# EasyEDA Pro project JLCEDA_AT_START_F455_V1.0.epro, schematic AT-START-F455 V1.0

## Sheets
1 MCU: Board Name: AT-START-F455_v1.0; Create Date: 2024-11-06; Page Name: MCU; Project Name: AT-START-F455; Schematic Name: AT-START-F455 V1.0; Update Date: 2024-12-31; Company: Artery Technology; Drawed: SD; Page Size: A4; Version: 1.0
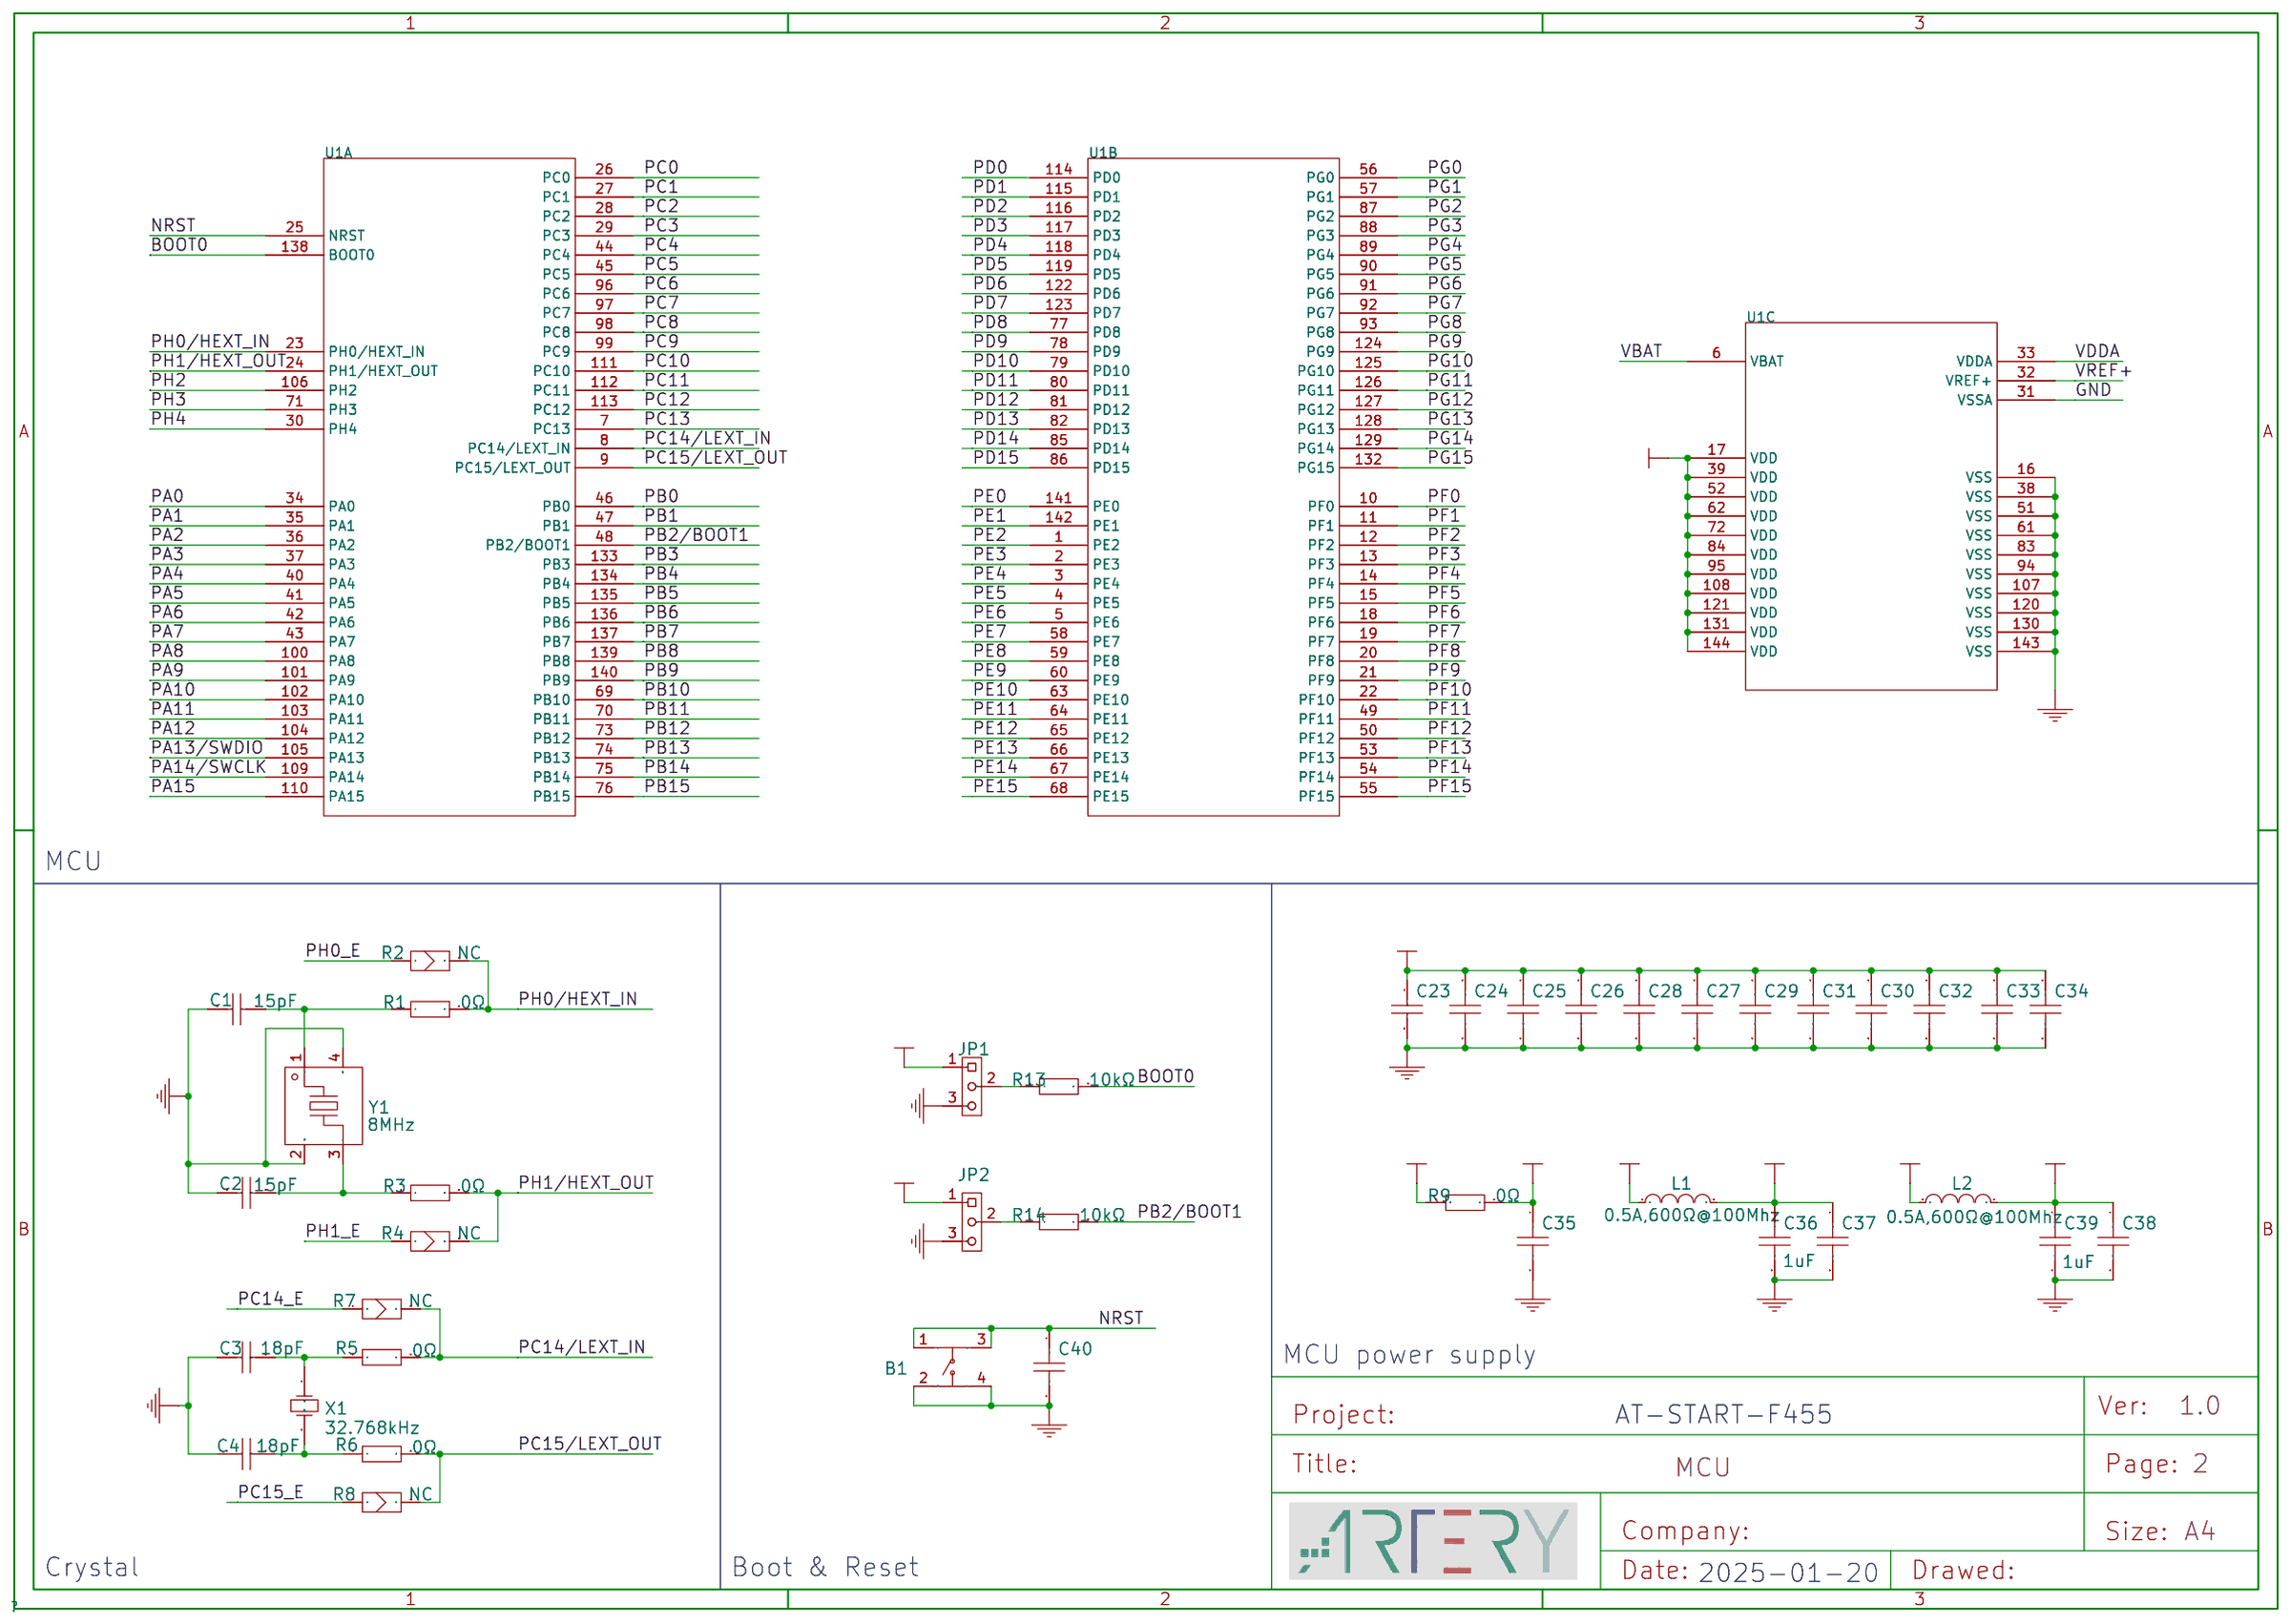
[diagram p0: MCU]
2 Power & Peripherals: Page Name: Power & Peripherals; Update Date: 2025-01-22
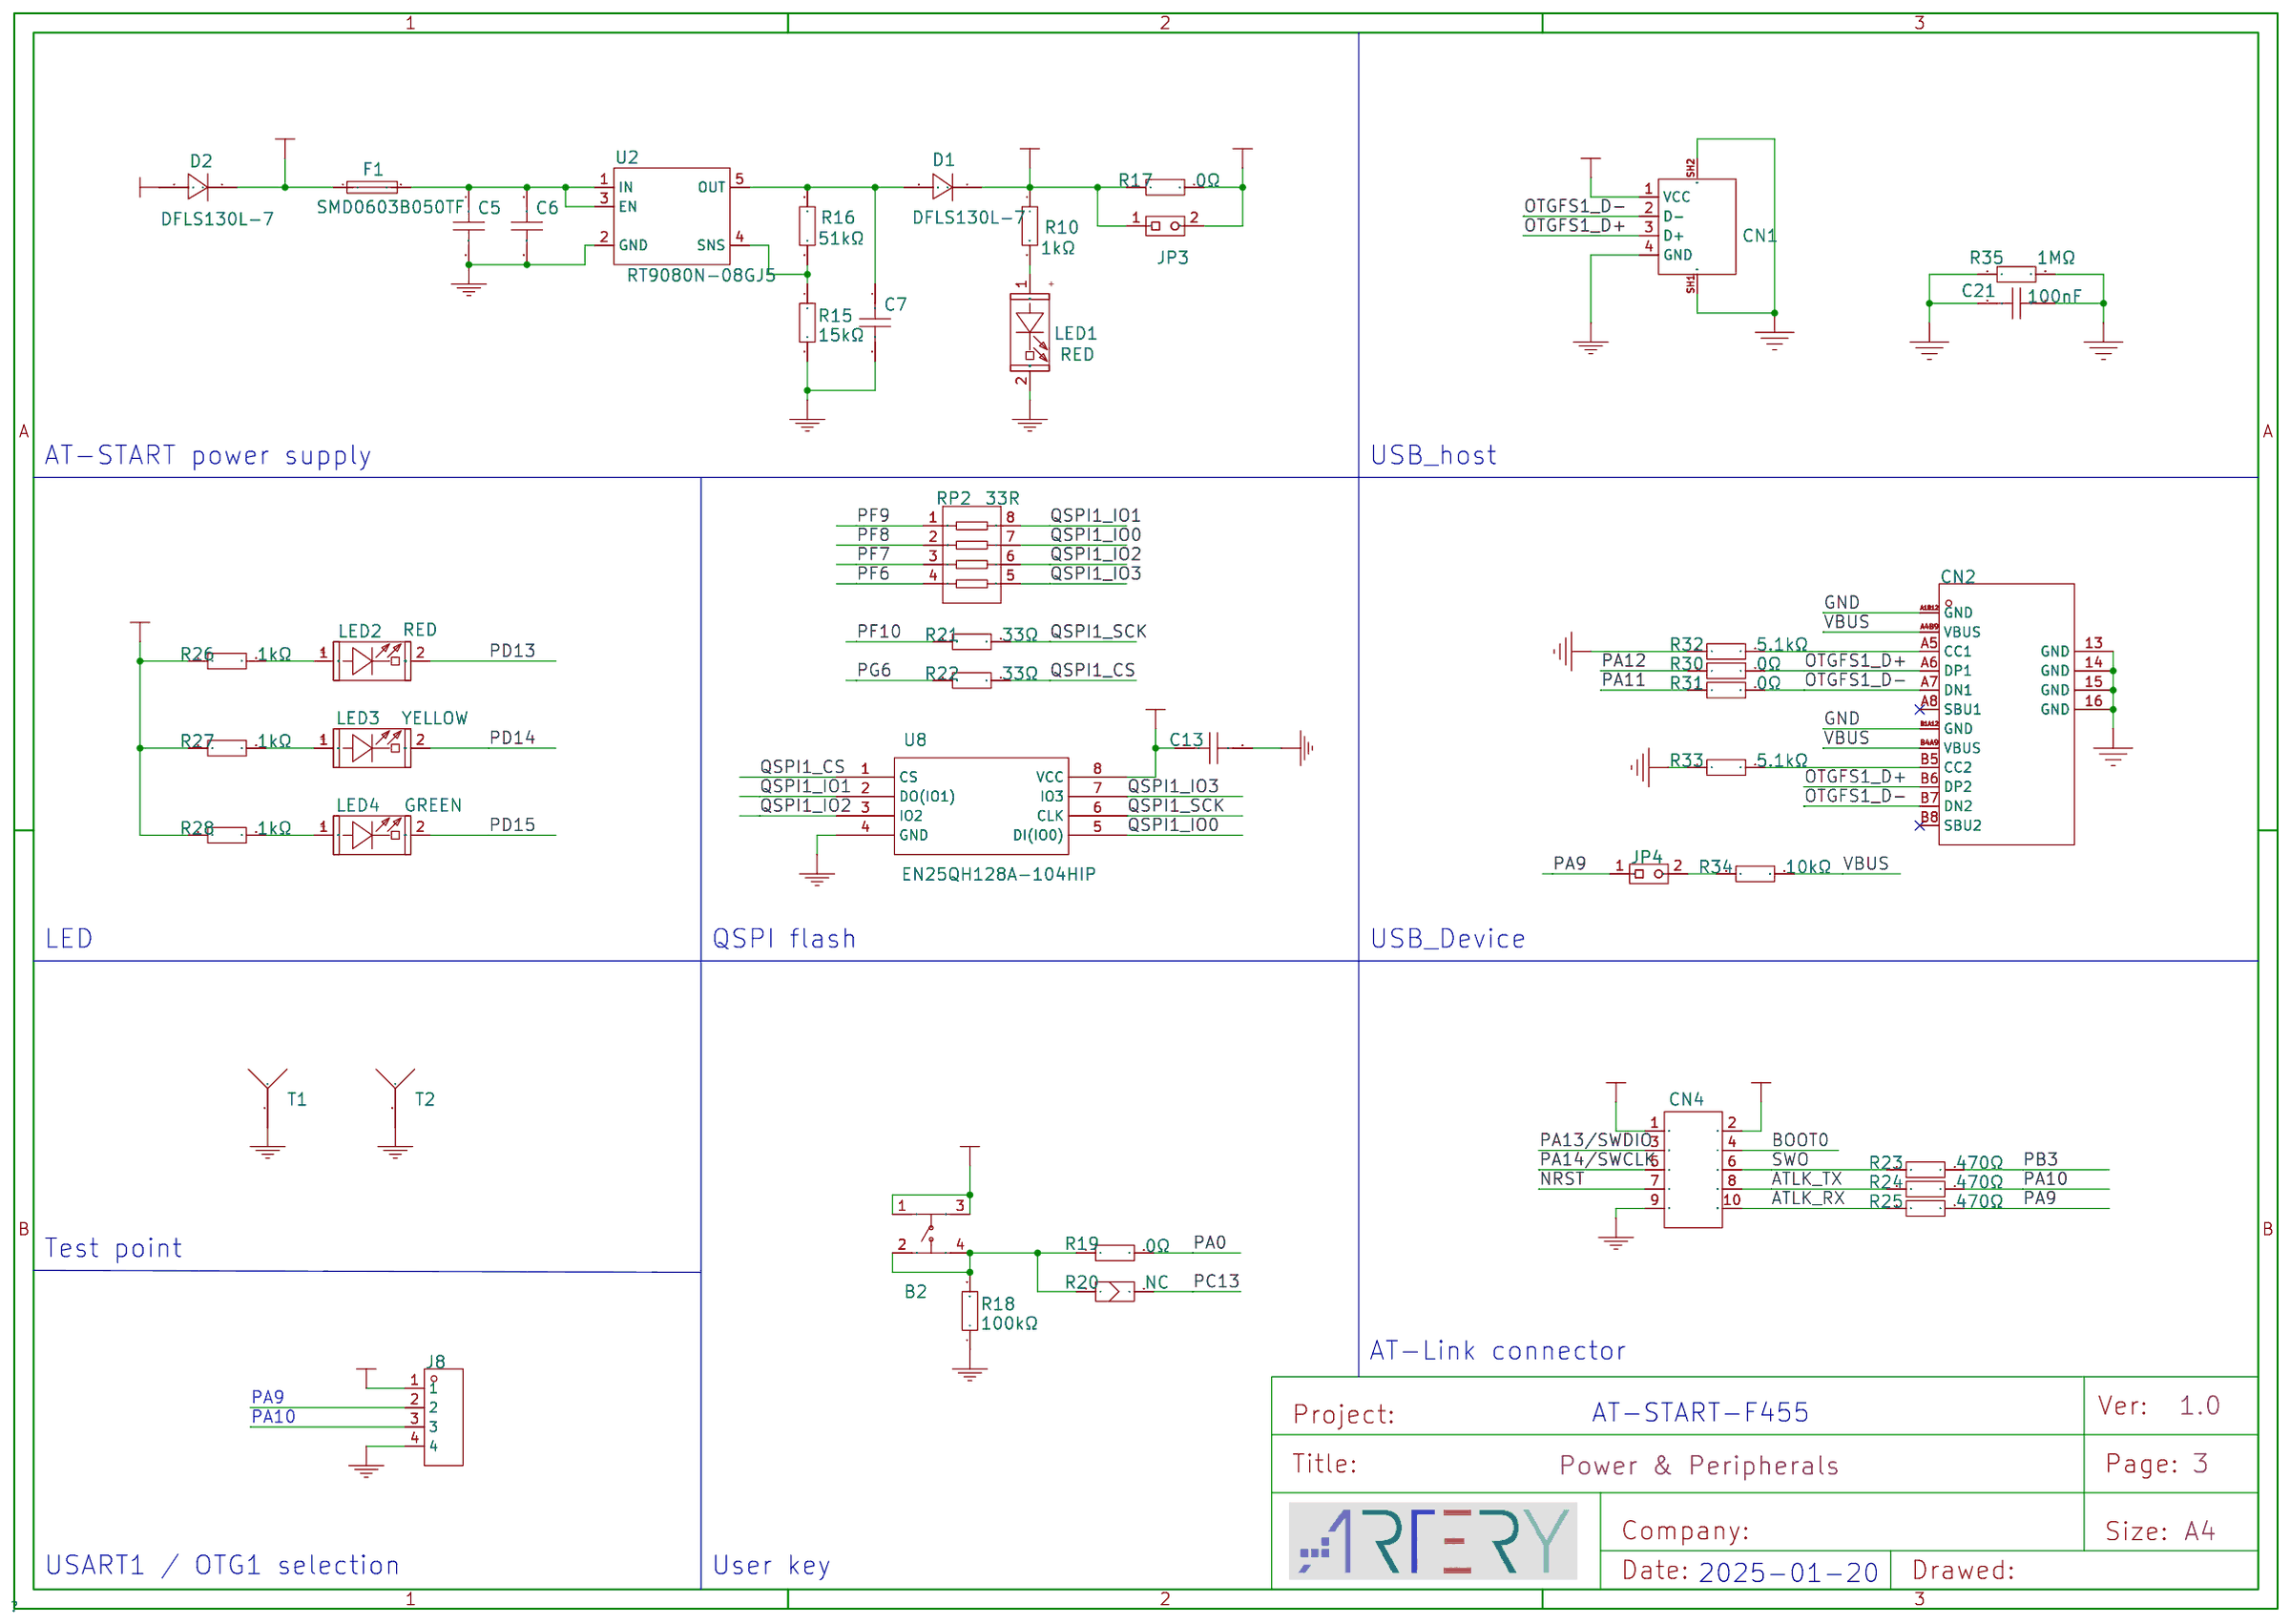
[diagram p1: Power & Peripherals]
3 Extension connectors: Page Name: Extension connectors
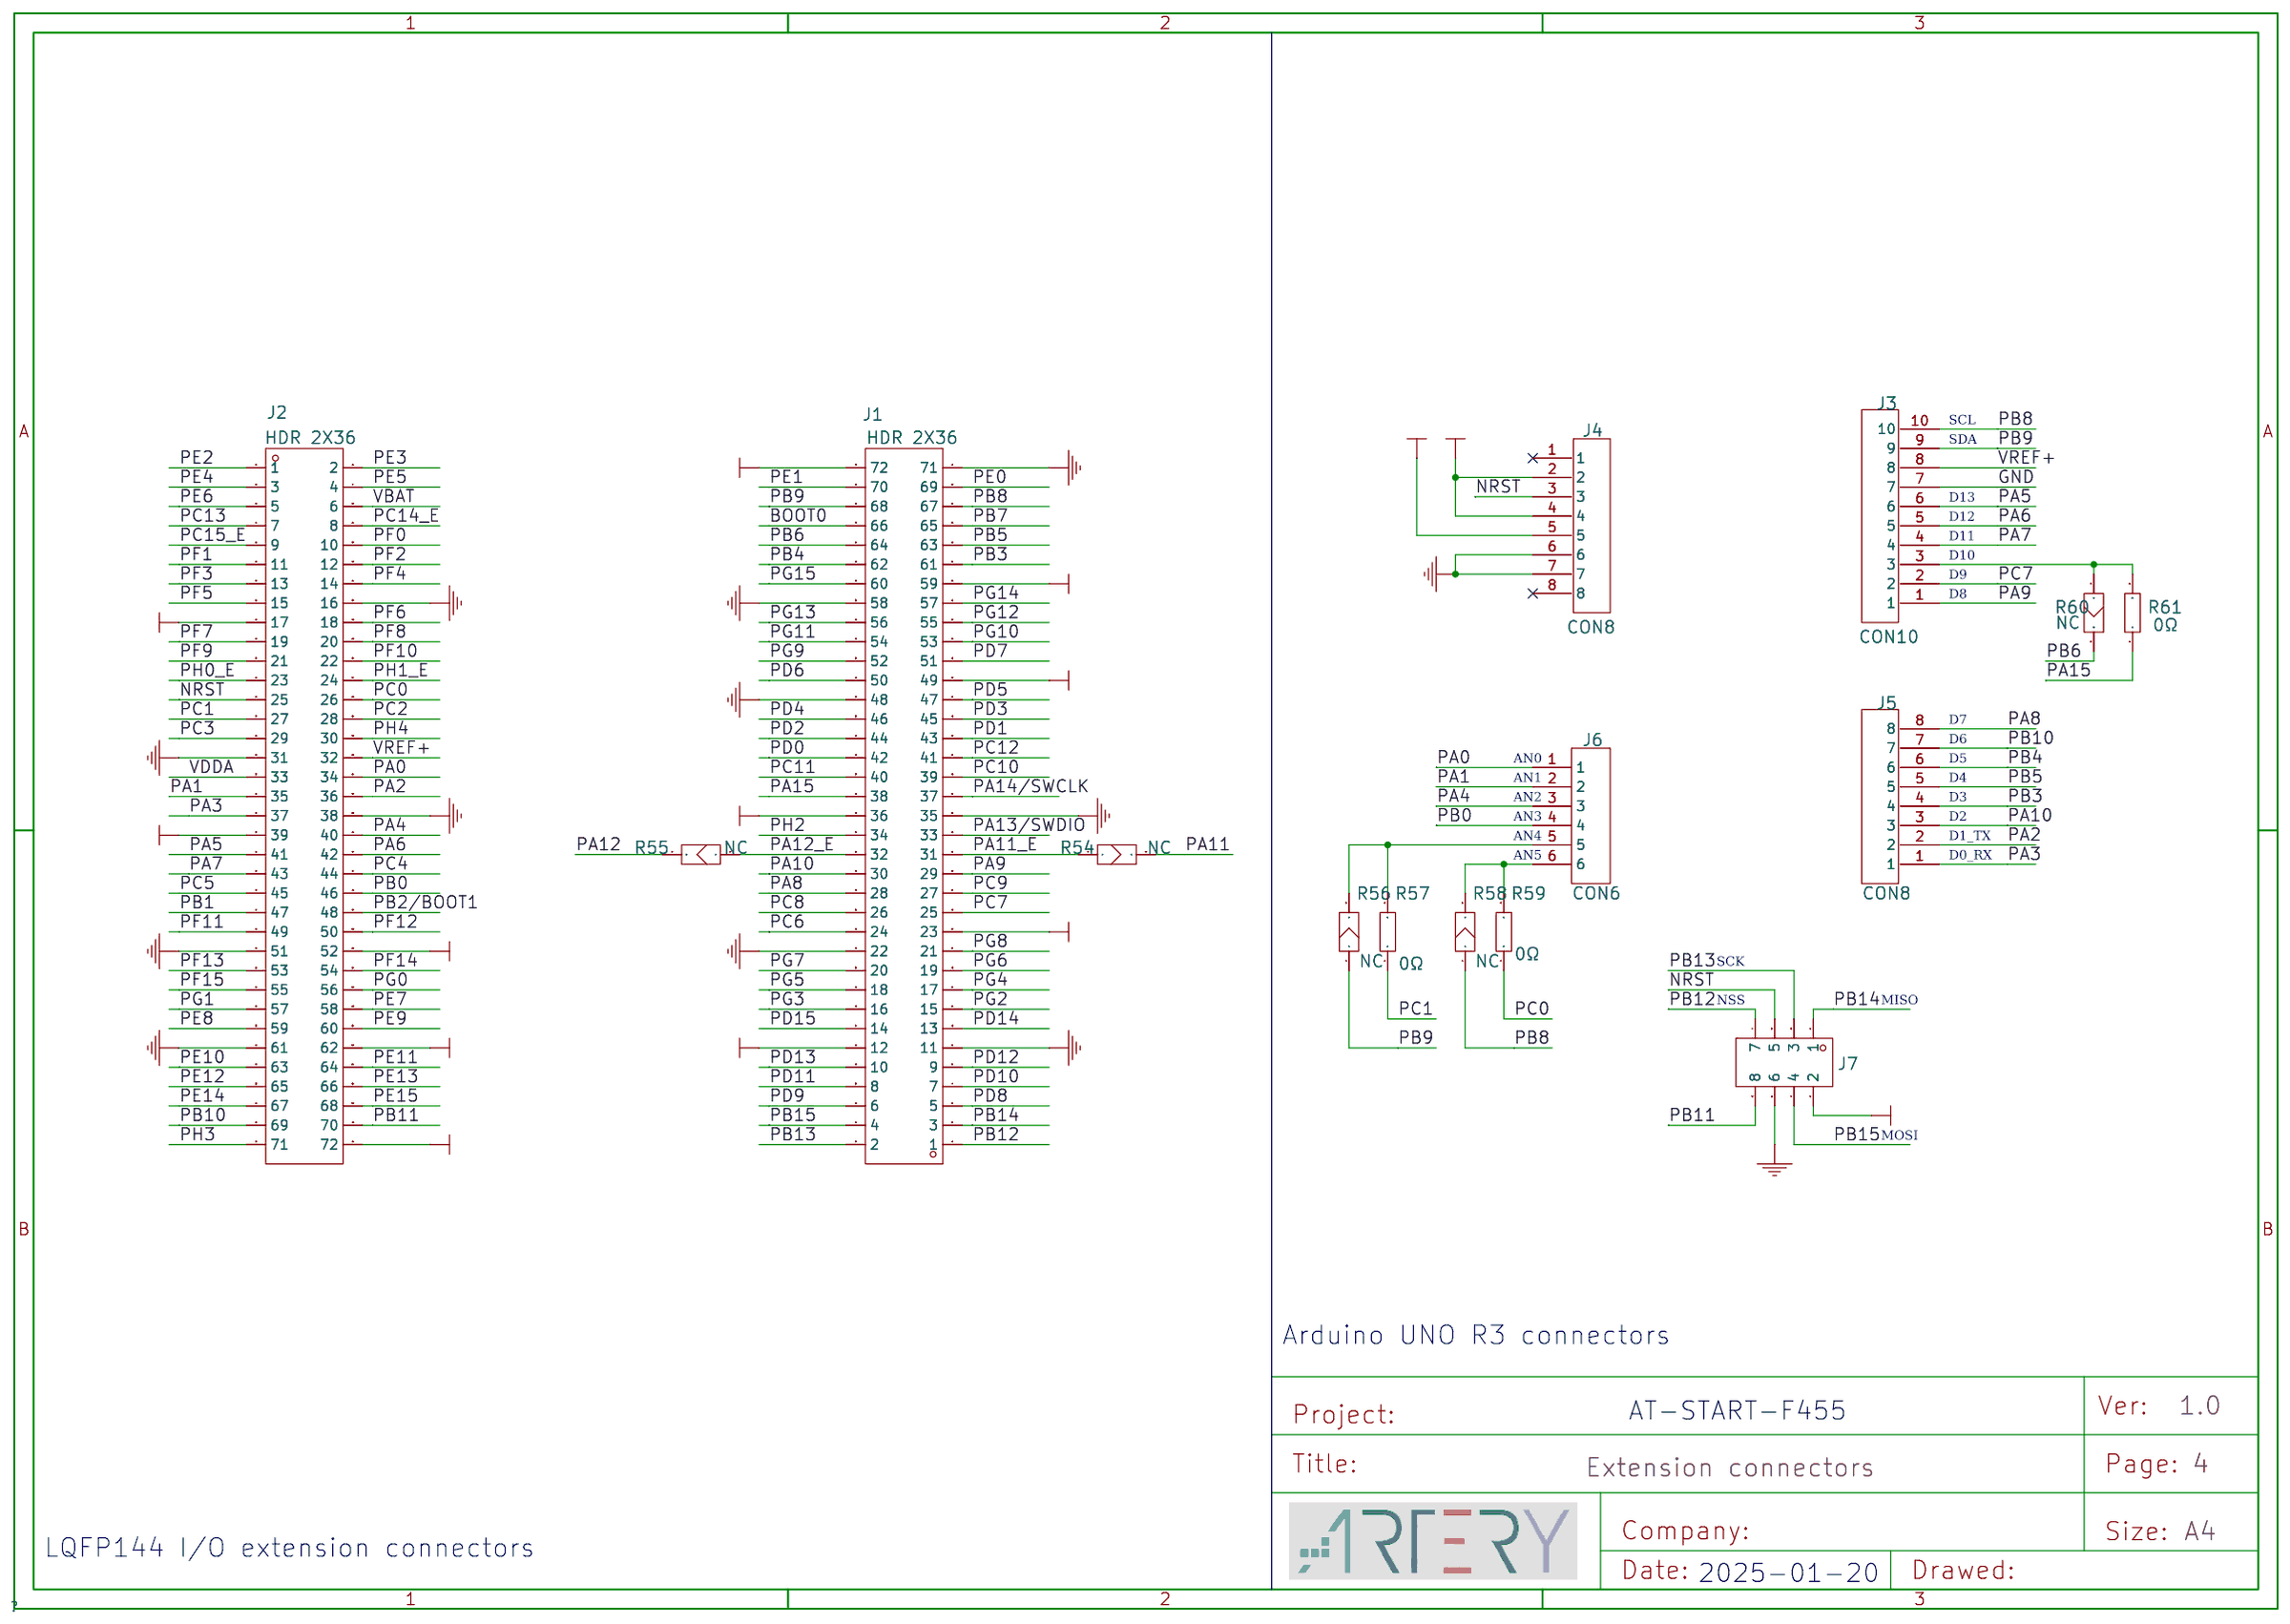
[diagram p2: Extension connectors]
4 AT-Link-EZ-V1.4: Page Name: AT-Link-EZ-V1.4
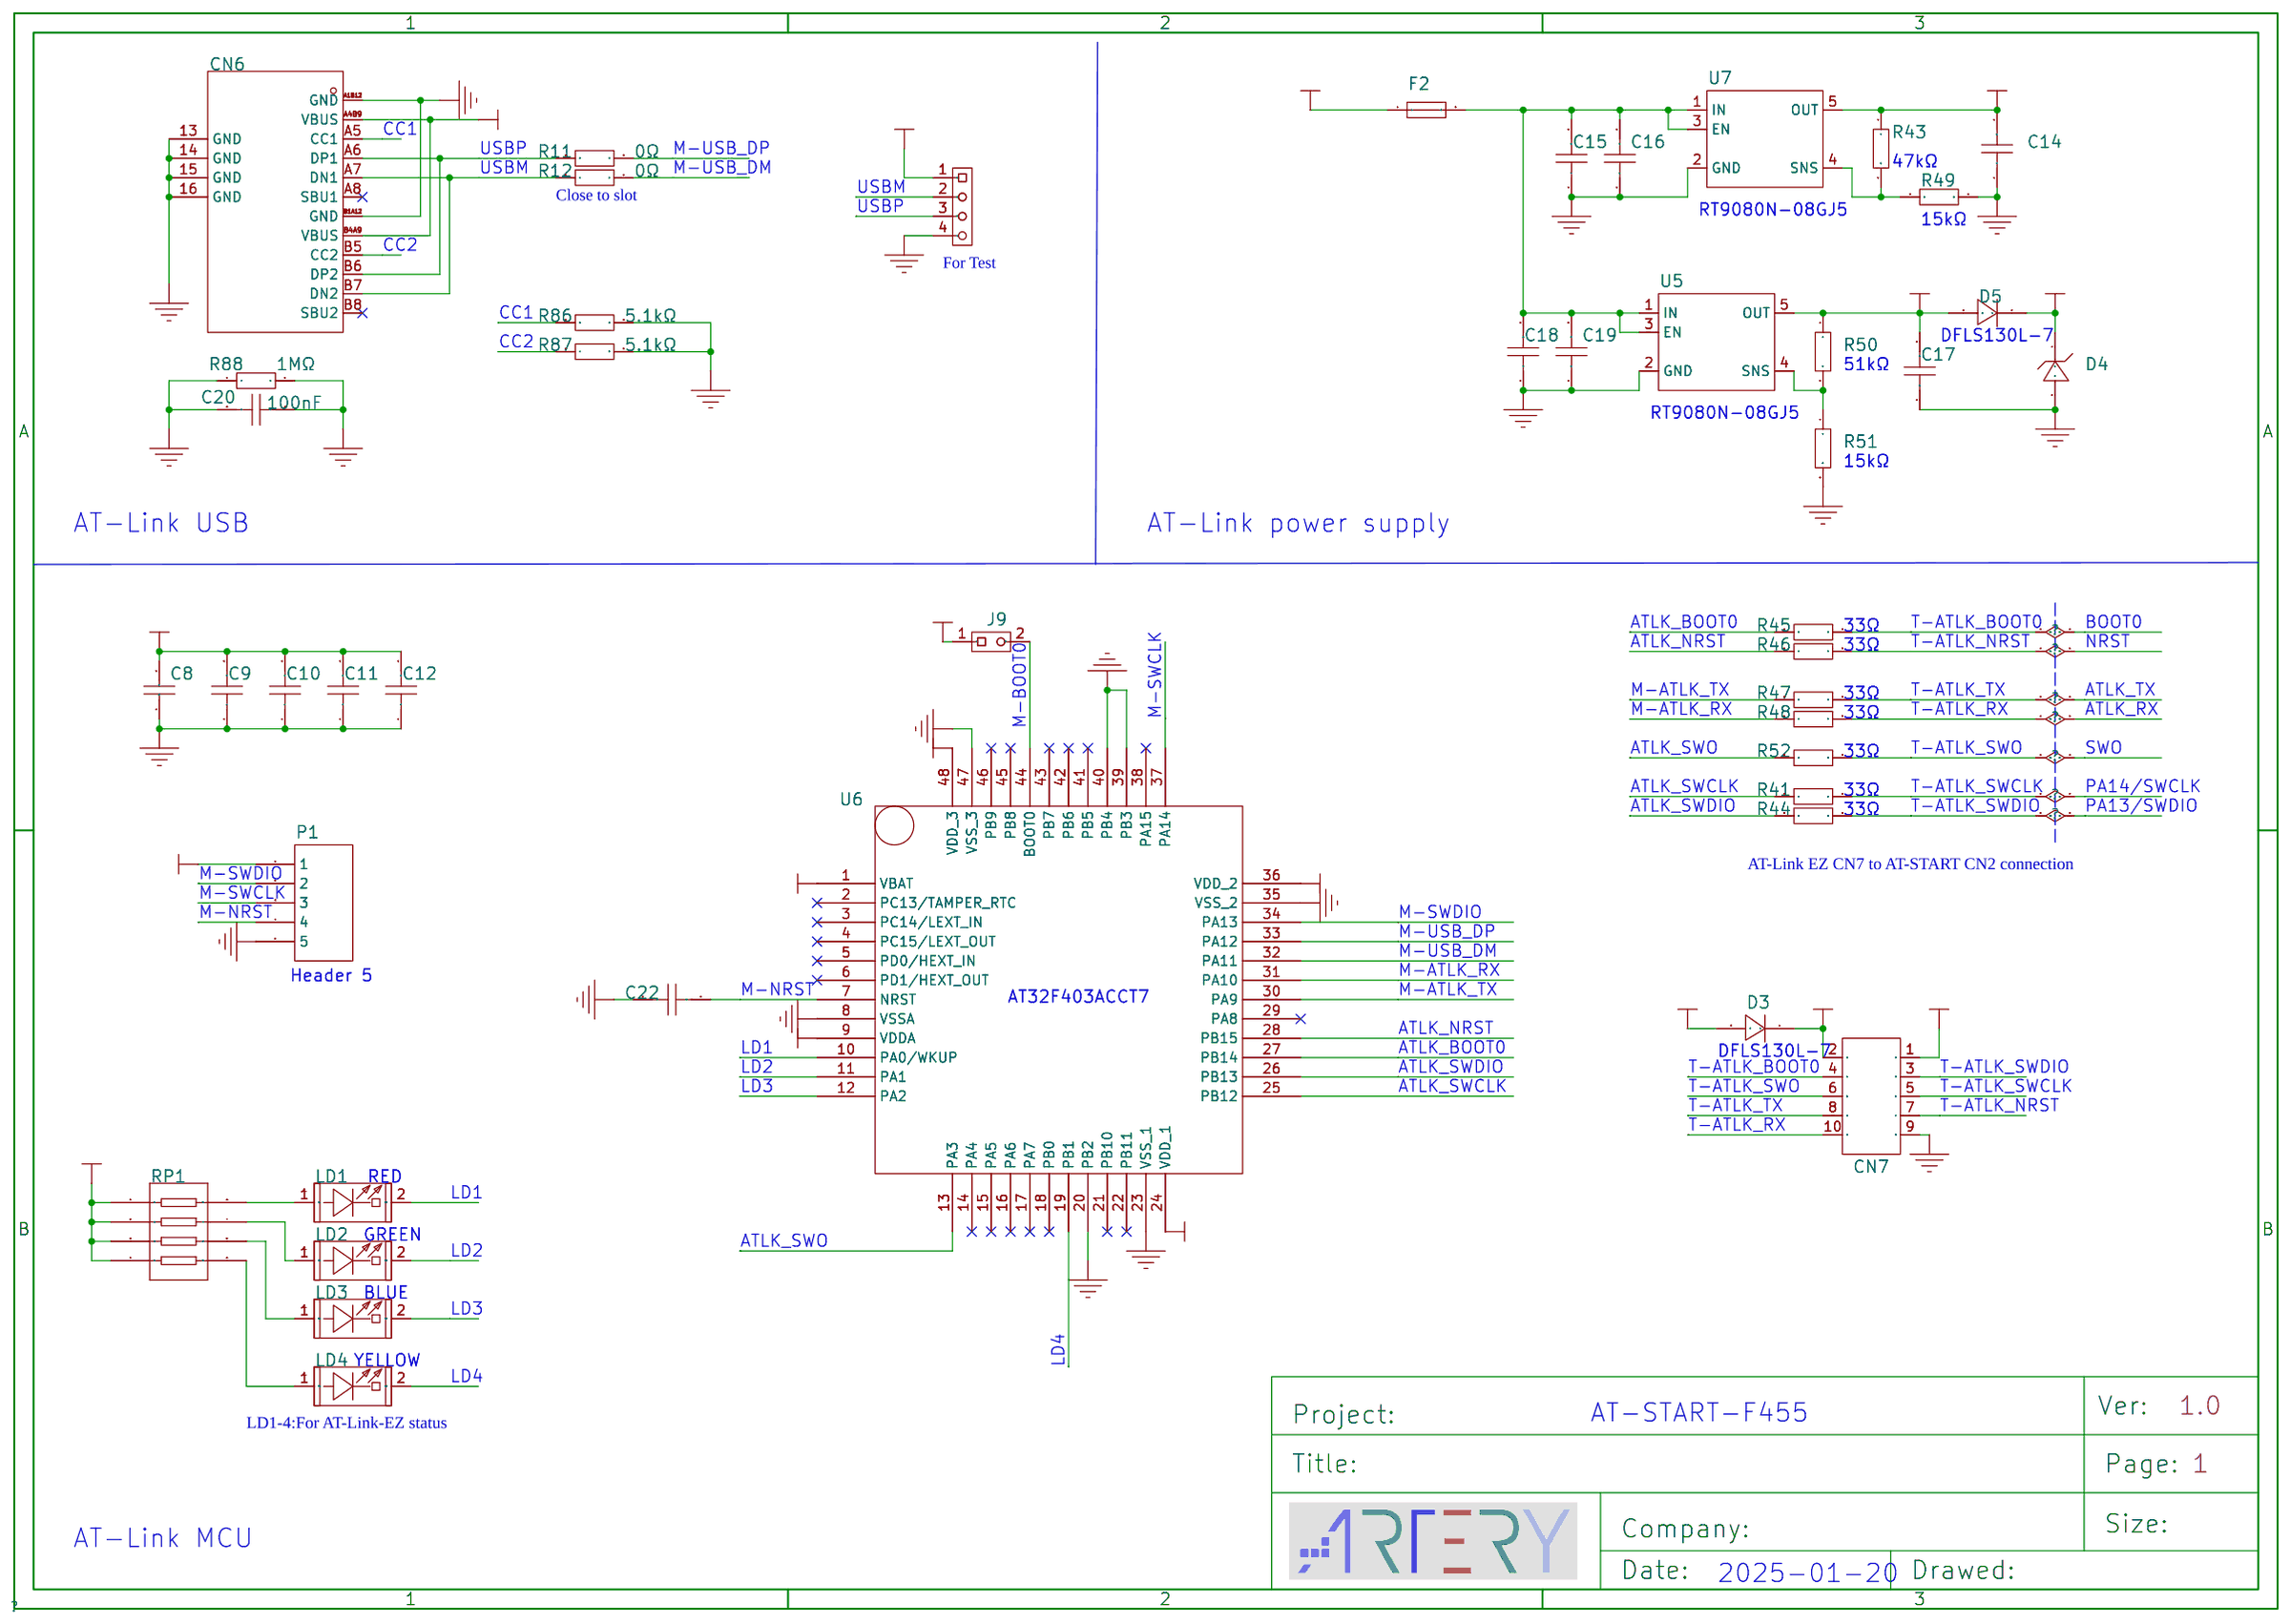
[diagram p3: AT-Link-EZ-V1.4]

## Parts
sheet AT-Link-EZ-V1.4
C8  4.7uF  [C0603]
C9  100nF  [C0603]
C10  100nF  [C0603]
C11  100nF  [C0603]
C12  100nF  [C0603]
C14  10uF  [C0603]
C15  10uF  [C0603]
C16  100nF  [C0603]
C17  10uF  [C0603]
C18  10uF  [C0603]
C19  100nF  [C0603]
C20  100nF  [C0603]
C22  100nF  [C0603]
CN6  -  [USB-C-SMD_TYPEC-304-BCP16]
CN7  CON10  [HDR2X5]
D3  DFLS130L-7  [POWERDI-123_L2.8-W1.8-LS3.7-RD]
D4  SMF3.3A  [SOD-123FL_L2.8-W1.8-LS3.8-RD]
D5  DFLS130L-7  [POWERDI-123_L2.8-W1.8-LS3.7-RD]
F2  BSMD0603-050-6V  [F0603]
J9  1X2P_2.54M  [HDR1X2]
LD1  RED  [LED0603]
LD2  GREEN  [LED0603]
LD3  BLUE  [LED0603]
LD4  YELLOW  [LED0603]
P1  Header 5  [HDR1X5]
R11  0Ω  [R0603]
R12  0Ω  [R0603]
R41  33Ω  [R0603]
R43  47kΩ  [R0603]
R44  33Ω  [R0603]
R45  33Ω  [R0603]
R46  33Ω  [R0603]
R47  33Ω  [R0603]
R48  33Ω  [R0603]
R49  15kΩ  [R0603]
R50  51kΩ  [R0603]
R51  15kΩ  [R0603]
R52  33Ω  [R0603]
R86  5.1kΩ  [R0603]
R87  5.1kΩ  [R0603]
R88  1MΩ  [R0603]
RP1  1kΩ  [RES-ARRAY-SMD_0603-8P-L3.2-W1.6-BL]
TP3  1X4P_2.54F  [HDR1X4 - TOP]
U5  RT9080N-08GJ5  [SOT-23-5]
U6  AT32F403ACCT7  [LQFP48 - 2]
U7  RT9080N-08GJ5  [SOT-23-5]
sheet Extension connectors
J1  HDR 2X36  [HDR_2.54_2X36]
J2  HDR 2X36  [HDR_2.54_2X36]
J3  CON10  [FEMALE HEADER 1X10]
J4  CON8  [FEMALE HEADER 1X8]
J5  CON8  [FEMALE HEADER 1X8]
J6  CON6  [FEMALE HEADER 1X6]
J7  Header 4X2  [HDR2X4]
R54  NC  [SB-PAD]
R55  NC  [SB-PAD]
R56  NC  [SB-PAD]
R57  0Ω  [R0603]
R58  NC  [SB-PAD]
R59  0Ω  [R0603]
R60  NC  [SB-PAD]
R61  0Ω  [R0603]
sheet MCU
B1  贴片按键6*6*5 黑色  [SW-SMD_4P-L6.0-W6.0-P4.50-LS9.0]
C1  15pF  [C0603]
C2  15pF  [C0603]
C3  18pF  [C0603]
C4  18pF  [C0603]
C23  4.7uF  [C0603]
C24  100nF  [C0603]
C25  100nF  [C0603]
C26  100nF  [C0603]
C27  100nF  [C0603]
C28  100nF  [C0603]
C29  100nF  [C0603]
C30  100nF  [C0603]
C31  100nF  [C0603]
C32  100nF  [C0603]
C33  100nF  [C0603]
C34  100nF  [C0603]
C35  100nF  [C0603]
C36  1uF  [C0603]
C37  100nF  [C0603]
C38  100nF  [C0603]
C39  1uF  [C0603]
C40  100nF  [C0603]
JP1  Jumper 1x3P  [HEADER 1X3]
JP2  Jumper 1x3P  [HEADER 1X3]
L1  0.5A,600Ω@100Mhz  [0603_L]
L2  0.5A,600Ω@100Mhz  [0603_L]
R1  0Ω  [R0603]
R2  NC  [SB-PAD]
R3  0Ω  [R0603]
R4  NC  [SB-PAD]
R5  0Ω  [R0603]
R6  0Ω  [R0603]
R7  NC  [SB-PAD]
R8  NC  [SB-PAD]
R9  0Ω  [R0603]
R13  10kΩ  [R0603]
R14  10kΩ  [R0603]
U1  AT32F457ZET7  [LQFP144_20*20]  (sections 1,2,3)
X1  32.768kHz  [OSC-TH_BD2.0-P0.70-D0.3]
Y1  8MHz  [CRYSTAL-SMD_4P-L3.2-W2.5-BL]
sheet Power & Peripherals
B2  贴片按键6*6*5 红色  [SW-SMD_4P-L6.0-W6.0-P4.50-LS9.0]
C5  10uF  [C0603]
C6  100nF  [C0603]
C7  10uF  [C0603]
C13  100nF  [C0603]
C21  100nF  [C0603]
CN1  JTJ-USB-AF-08  [USB-A-TH__USB-AF-90]
CN2  -  [USB-C-SMD_TYPEC-304-BCP16]
CN4  CON10A_0  [HDR2X5]
D1  DFLS130L-7  [POWERDI-123_L2.8-W1.8-LS3.7-RD]
D2  DFLS130L-7  [POWERDI-123_L2.8-W1.8-LS3.7-RD]
F1  SMD0603B050TF  [R0603]
J8  PZ2.54-1*4-WZ  [HDR-TH_4P-P2.54-H-M-W7.7-P]
JP3  Jumper 1x2P  [HEADER 1X2]
JP4  Jumper 1x2P  [HEADER 1X2]
LED1  RED  [LED0603]
LED2  RED  [LED0603]
LED3  YELLOW  [LED0603]
LED4  GREEN  [LED0603]
R10  1kΩ  [R0603]
R15  15kΩ  [R0603]
R16  51kΩ  [R0603]
R17  0Ω  [R0603]
R18  100kΩ  [R0603]
R19  0Ω  [R0603]
R20  NC  [SB-PAD]
R21  33Ω  [R0603]
R22  33Ω  [R0603]
R23  470Ω  [R0603]
R24  470Ω  [R0603]
R25  470Ω  [R0603]
R26  1kΩ  [R0603]
R27  1kΩ  [R0603]
R28  1kΩ  [R0603]
R30  0Ω  [R0603]
R31  0Ω  [R0603]
R32  5.1kΩ  [R0603]
R33  5.1kΩ  [R0603]
R34  10kΩ  [R0603]
R35  1MΩ  [R0603]
RP2  33R  [0603*4,8P4R]
T1  TESTPOINT TP-5006  [TESTHOOK]
T2  TESTPOINT TP-5006  [TESTHOOK]
U2  RT9080N-08GJ5  [SOT-23-5]
U8  EN25QH128A-104HIP  [SOIC-8_208MIL]

## Library data of the parts
C8 = CL10A475KO8NNNC: 容值:4.7uF;精度:±10%;额定电压:16V;材质(温度系数):X5R;; LCSC Part Name: 4.7uF ±10% 16V; Supplier Part: C19666; Manufacturer: SAMSUNG(三星); Supplier Footprint: 0603; JLCPCB Part Class: Basic Part; Datasheet: https://atta.szlcsc.com/upload/public/pdf/source/20160218/1457707763339.pdf; Supplier: LCSC; Tolerance: ±10%; Voltage Rated: 16V; Temperature Coefficient: X5R; Design Item ID: Cap Semi; Library Name: PcbLib; Published: 8-Jun-2000; LatestRevisionDate: 29-May-2009; LatestRevisionNote: IPC-7351 Footprint Added.; PackageReference: C1206; Publisher: Altium Limited; PackageDescription: Chip Capacitor; Origin Footprint 2: 0603; Origin Footprint 3: 0402; Origin Footprint 4: C2512; Origin Footprint 5: 1608[0603]; Origin Footprint 6: C1210
C9-C12 = CC0603KRX7R9BB104: 容值:100nF;精度:±10%;额定电压:50V;材质(温度系数):X7R;; LCSC Part Name: 100nF ±10% 50V; Supplier Part: C14663; Manufacturer: YAGEO(国巨); Supplier Footprint: 0603; JLCPCB Part Class: Basic Part; Datasheet: https://atta.szlcsc.com/upload/public/pdf/source/20180910/C282072_33301C7F631E79921B82A8DAC6BCC5B3.pdf; Supplier: LCSC; Tolerance: ±10%; Voltage Rated: 50V; Temperature Coefficient: X7R; Design Item ID: Cap Semi; Library Name: PcbLib; Published: 8-Jun-2000; LatestRevisionDate: 29-May-2009; LatestRevisionNote: IPC-7351 Footprint Added.; PackageReference: C1206; Publisher: Altium Limited; PackageDescription: Chip Capacitor; Origin Footprint 2: 0603; Origin Footprint 3: 0402; Origin Footprint 4: C2512; Origin Footprint 5: 1608[0603]; Origin Footprint 6: C1210
C14 C15 C17 C18 = CL10A106KP8NNNC: 容值:10uF;精度:±10%;额定电压:10V;材质(温度系数):X5R;; LCSC Part Name: 10uF ±10% 10V; Supplier Part: C19702; Manufacturer: SAMSUNG(三星); Supplier Footprint: 0603; JLCPCB Part Class: Basic Part; Datasheet: https://atta.szlcsc.com/upload/public/pdf/source/20160218/1457707763339.pdf; Supplier: LCSC; Tolerance: ±10%; Voltage Rated: 10V; Temperature Coefficient: X5R; Design Item ID: 0.1uF,50V,20%,SMD0603; Library Name: *
C16 C19 C22 = CC0603KRX7R9BB104: 容值:100nF;精度:±10%;额定电压:50V;材质(温度系数):X7R;; LCSC Part Name: 100nF ±10% 50V; Supplier Part: C14663; Manufacturer: YAGEO(国巨); Supplier Footprint: 0603; JLCPCB Part Class: Basic Part; Datasheet: https://atta.szlcsc.com/upload/public/pdf/source/20180910/C282072_33301C7F631E79921B82A8DAC6BCC5B3.pdf; Supplier: LCSC; Tolerance: ±10%; Voltage Rated: 50V; Temperature Coefficient: X7R; Design Item ID: 0.1uF,50V,20%,SMD0603; Library Name: *
C6 C13 C20 C21 C24-C35 C37 C38 C40 = CC0603KRX7R9BB104: 容值:100nF;精度:±10%;额定电压:50V;材质(温度系数):X7R;; LCSC Part Name: 100nF ±10% 50V; Supplier Part: C14663; Manufacturer: YAGEO(国巨); Supplier Footprint: 0603; JLCPCB Part Class: Basic Part; Datasheet: https://atta.szlcsc.com/upload/public/pdf/source/20180910/C282072_33301C7F631E79921B82A8DAC6BCC5B3.pdf; Supplier: LCSC; Tolerance: ±10%; Voltage Rated: 50V; Temperature Coefficient: X7R
CN2 CN6 = TYPEC-304-BCP16: 连接器类型:Type-C;标准:USB 3.1;公母:母座;触点数量:16.0;端口数量:1;安装方式:卧贴;额定电流 - 电源:3A;工作温度范围:-25~+85;焊接温度(最大值):260;; Supplier Part: C720629; Manufacturer: XUNPU(讯普); Supplier Footprint: SMD; JLCPCB Part Class: Extended Part; Datasheet: https://atta.szlcsc.com/upload/public/pdf/source/20211022/DACD6552F639E9483017DE6DC0E61150.pdf; Supplier: LCSC; Connector Type: Type-C; Standard: USB 3.1; Gender: 母座; Number of Contacts: 16.0; Number of Ports: 1; Mounting Sytle: 卧贴; Current Rating - Power (Max): 3A; Operating Temperature Range: -25~+85; Welding Temperature (Max): 260
CN7 = CON10: 简易牛角DC3-10P 双排90度弯插针 2.54mm 2*5P双排 黑色; Design Item ID: CON10A_0; Library Name: *
D3 D5 = DFLS130L-7: 正向压降(Vf):310mV@1A;直流反向耐压(Vr):30V;平均整流电流(Io):1A;; LCSC Part Name: 电压:30V 电流:1A; Supplier Part: C110493; Manufacturer: DIODES(美台); Supplier Footprint: Power-DI-123; JLCPCB Part Class: Extended Part; Datasheet: https://atta.szlcsc.com/upload/public/pdf/source/20170427/1493286393645.pdf; Supplier: LCSC; Forward Voltage (Vf@If): 310mV@1A; Reverse Voltage (Vr): 30V; Average Rectified Current (Io): 1A; Design Item ID: Diode; Library Name: Miscellaneous Devices; Published: 8-Jun-2000; LatestRevisionDate: 17-Jul-2002; LatestRevisionNote: Re-released for DXP Platform.; PackageVersion: Sep-1996; PackageReference: SMC; Publisher: Altium Limited; PackageDescription: DO-214-AB/SMC; 2 C-Bend Leads; Body 7.9 x 5.9 mm, inc. leads (LxW); Code_JEDEC: DO-214-AB
D4 = SMF3.3A_C2759873: 反向截止电压(Vrwm):3.3V;最大钳位电压:7.3V;峰值脉冲电流(Ipp)@10/1000us:27.5A;击穿电压:4.1V;; Supplier Part: C2759873; Manufacturer: Leiditech(雷卯电子); Supplier Footprint: SOD-123FL; JLCPCB Part Class: Extended Part; Datasheet: https://atta.szlcsc.com/upload/public/pdf/source/20210330/C2759873_54039300A94B4A929A30F4E6BEAFC556.pdf; Supplier: LCSC; Reverse Stand-Off Voltage (Vrwm): 3.3V; Maximum Clamping Voltage: 7.3V; Peak Pulse Current (Ipp)@10/1000us: 27.5A; Breakdown Voltage: 4.1V; Reverse Leakage Current (Ir): 500uA; Type: TVS; Design Item ID: Diode; Library Name: Miscellaneous Devices; Published: 8-Jun-2000; LatestRevisionDate: 17-Jul-2002; LatestRevisionNote: Re-released for DXP Platform.; PackageVersion: Sep-1996; PackageReference: SMC; Publisher: Altium Limited; PackageDescription: DO-214-AB/SMC; 2 C-Bend Leads; Body 7.9 x 5.9 mm, inc. leads (LxW); Code_JEDEC: DO-214-AB
F2 = BSMD0603-050-6V: 最大电压:6V;最大电流:40A;保持电流:500mA;跳闸电流:1A;; LCSC Part Name: 6V 500mA 0603自恢复; Supplier Part: C883095; Manufacturer: BHFUSE(佰宏); Supplier Footprint: 0603; JLCPCB Part Class: Extended Part; Datasheet: https://atta.szlcsc.com/upload/public/pdf/source/20230512/E478DE3555A0061DA0124A9F45802B86.pdf; Supplier: LCSC; Operating Voltage (Max): 6V; Current Rating (Max): 40A; Hold Current: 500mA; Trip Current: 1A; Power Dissipation: 500mW; Resistance - Initial (Ri) (Min): 100mΩ; Resistance - Post Trip (R1) (Max): 800mΩ; Maximum Time to Trip: 100ms; Operating Temperature: -40℃~+85℃; Design Item ID: Fuse 1; Library Name: Miscellaneous Devices; Published: 8-Jun-2000; LatestRevisionDate: 17-Jul-2002; LatestRevisionNote: Re-released for DXP Platform.; PackageReference: PIN-W2/E2.8; Publisher: Altium Limited; PackageDescription: Thru-Hole; 2 Leads
J9 = 1X2P_2.54M: 单排直插针1*2P 2.54mm（黑色）; Origin Footprint 2: SIP_2P; Design Item ID: 1X2P,Male,DIP_2.54; Library Name: *; Check: true
LD1 = RED: 贴片LED 红色  0603; Design Item ID: RED,SMD0603; Library Name: AT32F403_TINY_LQFP144_Library
LD2 = GREEN: 贴片LED 绿色 0603; Design Item ID: GREEN,SMD0603; Library Name: AT32F403_TINY_LQFP144_Library
LD3 = BLUE: 贴片LED 蓝色 0603; Design Item ID: BLUE,SMD0603; Library Name: AT_START_F415
LD4 = YELLOW: 贴片LED 黄色 0603; Design Item ID: YELLOW,SMD0603; Library Name: Schlib1
P1 = Header 5: 单排直插针1*5P 2.54mm （黑色）; LatestRevisionDate: 17-Jul-2002; LatestRevisionNote: Re-released for DXP Platform.; Publisher: Altium Limited; Library Name: Miscellaneous Connectors
R11 R12 = 0603WAF0000T5E: 电阻类型:厚膜电阻;阻值:0Ω;精度:±1%;功率:1/10W;温度系数:-;最大工作电压:75V;工作温度范围:-55~+155;; LCSC Part Name: 0Ω ±1%; Supplier Part: C21189; Manufacturer: UNI-ROYAL(厚声); Supplier Footprint: 0603; JLCPCB Part Class: Basic Part; Datasheet: https://atta.szlcsc.com/upload/public/pdf/source/20200306/C422600_1E6D84923E4A46A82E41ADD87F860B5C.pdf; Supplier: LCSC; Type: 厚膜电阻; Tolerance: ±1%; Power(Watts): 1/10W; Overload Voltage (Max): 75V; Operating Temperature Range: -55~+155
R41 R44-R48 R52 = 0603WAF330JT5E: 电阻类型:厚膜电阻;阻值:33Ω;精度:±1%;功率:100mW;温度系数:±100ppm/℃;最大工作电压:75V;工作温度范围:-55℃~+155℃;; LCSC Part Name: 33Ω ±1% 100mW; Supplier Part: C23140; Manufacturer: UNI-ROYAL(厚声); Supplier Footprint: 0603; JLCPCB Part Class: Basic Part; Datasheet: https://atta.szlcsc.com/upload/public/pdf/source/20200306/C422600_1E6D84923E4A46A82E41ADD87F860B5C.pdf; Supplier: LCSC; Type: 厚膜电阻; Tolerance: ±1%; Power(Watts): 100mW; Temperature Coefficient: ±100ppm/℃; Overload Voltage (Max): 75V; Operating Temperature Range: -55℃~+155℃; Design Item ID: 22,1/10W,1%,SMD0603; Library Name: *
R43 = 0603WAF4702T5E: 电阻类型:厚膜电阻;阻值:47kΩ;精度:±1%;功率:100mW;温度系数:±100ppm/℃;最大工作电压:75V;工作温度范围:-55℃~+155℃;; LCSC Part Name: 47kΩ ±1% 100mW; Supplier Part: C25819; Manufacturer: UNI-ROYAL(厚声); Supplier Footprint: 0603; JLCPCB Part Class: Basic Part; Datasheet: https://atta.szlcsc.com/upload/public/pdf/source/20200306/C422600_1E6D84923E4A46A82E41ADD87F860B5C.pdf; Supplier: LCSC; Type: 厚膜电阻; Tolerance: ±1%; Power(Watts): 100mW; Temperature Coefficient: ±100ppm/℃; Overload Voltage (Max): 75V; Operating Temperature Range: -55℃~+155℃; Design Item ID: 470,1/10W,1%,SMD0603; Library Name: *
R49 R51 = 0603WAF1502T5E: 电阻类型:厚膜电阻;阻值:15kΩ;精度:±1%;功率:100mW;温度系数:±100ppm/℃;最大工作电压:75V;工作温度范围:-55℃~+155℃;; LCSC Part Name: 15kΩ ±1% 100mW; Supplier Part: C22809; Manufacturer: UNI-ROYAL(厚声); Supplier Footprint: 0603; JLCPCB Part Class: Basic Part; Datasheet: https://atta.szlcsc.com/upload/public/pdf/source/20200306/C422600_1E6D84923E4A46A82E41ADD87F860B5C.pdf; Supplier: LCSC; Type: 厚膜电阻; Tolerance: ±1%; Power(Watts): 100mW; Temperature Coefficient: ±100ppm/℃; Overload Voltage (Max): 75V; Operating Temperature Range: -55℃~+155℃; Design Item ID: 470,1/10W,1%,SMD0603; Library Name: *
R50 = 0603WAF5102T5E: 电阻类型:厚膜电阻;阻值:51kΩ;精度:±1%;功率:100mW;温度系数:±100ppm/℃;最大工作电压:75V;工作温度范围:-55℃~+155℃;; LCSC Part Name: 51kΩ ±1% 100mW; Supplier Part: C23196; Manufacturer: UNI-ROYAL(厚声); Supplier Footprint: 0603; JLCPCB Part Class: Basic Part; Datasheet: https://atta.szlcsc.com/upload/public/pdf/source/20200306/C422600_1E6D84923E4A46A82E41ADD87F860B5C.pdf; Supplier: LCSC; Type: 厚膜电阻; Tolerance: ±1%; Power(Watts): 100mW; Temperature Coefficient: ±100ppm/℃; Overload Voltage (Max): 75V; Operating Temperature Range: -55℃~+155℃; Design Item ID: 470,1/10W,1%,SMD0603; Library Name: *
R32 R33 R86 R87 = 0603WAF5101T5E: 电阻类型:厚膜电阻;阻值:5.1kΩ;精度:±1%;功率:1/10W;温度系数:±100ppm/;最大工作电压:75V;工作温度范围:-55~+155;; LCSC Part Name: 5.1kΩ ±1%; Supplier Part: C23186; Manufacturer: UNI-ROYAL(厚声); Supplier Footprint: 0603; JLCPCB Part Class: Basic Part; Datasheet: https://atta.szlcsc.com/upload/public/pdf/source/20200306/C422600_1E6D84923E4A46A82E41ADD87F860B5C.pdf; Supplier: LCSC; Type: 厚膜电阻; Tolerance: ±1%; Power(Watts): 1/10W; Temperature Coefficient: ±100ppm/; Overload Voltage (Max): 75V; Operating Temperature Range: -55~+155
R35 R88 = RC0603FR-071ML: 阻值:1MΩ;精度:±1%;功率:100mW;温度系数:±100ppm/;最大工作电压:75V;工作温度范围:-55~+155;; LCSC Part Name: 1MΩ ±1%; Supplier Part: C105578; Manufacturer: YAGEO(国巨); Supplier Footprint: 0603; JLCPCB Part Class: Extended Part; Datasheet: https://atta.szlcsc.com/upload/public/pdf/source/20181102/C105578_67A9388250AF143DE4682E62257D2969.pdf; Supplier: LCSC; Tolerance: ±1%; Power(Watts): 100mW; Temperature Coefficient: ±100ppm/; Overload Voltage (Max): 75V; Operating Temperature Range: -55~+155
RP1 = 4D03WGJ0102T5E: 电阻器数:4;阻值:1kΩ;精度:±5%;单个元件功率:62.5mW;温度系数:±200ppm/℃;; LCSC Part Name: 1kΩ ±5%; Supplier Part: C20197; Manufacturer: UNI-ROYAL(厚声); Supplier Footprint: 0603x4; JLCPCB Part Class: Basic Part; Datasheet: https://atta.szlcsc.com/upload/public/pdf/source/20191224/C474318_2527498AE30E813171187CCD28401A71.pdf; Supplier: LCSC; Number of Resistors: 4; Tolerance: ±5%; Power(Watts): 62.5mW; Temperature Coefficient: ±200ppm/℃; Number of Pins: 8; Design Item ID: 22,1/16W,5%,8P4R; Library Name: *
TP3 = 1X4P_2.54F
U5 U7 = RT9080N-08GJ5: Design Item ID: RT9080N; Library Name: SCM_START_402F
U6 = AT32F403CGT6: Design Item ID: LQFP48&amp;QFN48; Library Name: AT403-ALL-Package
J1 J2 = HDR 2X36
J3 = CON10
J4 J5 = CON8
J6 = CON6
J7 = Header 4X2: LatestRevisionDate: 17-Jul-2002; LatestRevisionNote: Re-released for DXP Platform.; Publisher: Altium Limited
R2 R4 R7 R8 R20 R54-R56 R58 R60 = NC
R1 R3 R5 R6 R9 R17 R19 R57 R59 R61 = 0603WAF0000T5E: 电阻类型:厚膜电阻;阻值:0Ω;精度:±1%;功率:100mW;最大工作电压:75V;工作温度范围:-55℃~+155℃;; LCSC Part Name: 0Ω ±1% 100mW; Supplier Part: C21189; Manufacturer: UNI-ROYAL(厚声); Supplier Footprint: 0603; JLCPCB Part Class: Basic Part; Datasheet: https://atta.szlcsc.com/upload/public/pdf/source/20200306/C422600_1E6D84923E4A46A82E41ADD87F860B5C.pdf; Supplier: LCSC; Type: 厚膜电阻; Tolerance: ±1%; Power(Watts): 100mW; Overload Voltage (Max): 75V; Operating Temperature Range: -55℃~+155℃
B1 B2 = K2-1102SP-C3SC-04: Supplier: LCSC; Supplier Part: C707347; Manufacturer: Korean Hroparts Elec; Paste Type: expand
C1 C2 = CL10C150JB8NNNC: 容值:15pF;精度:±5%;额定电压:50V;材质(温度系数):C0G;; LCSC Part Name: 15pF ±5% 50V; Supplier Part: C1644; Manufacturer: SAMSUNG(三星); Supplier Footprint: 0603; JLCPCB Part Class: Basic Part; Datasheet: https://atta.szlcsc.com/upload/public/pdf/source/20160218/1457707763339.pdf; Supplier: LCSC; Tolerance: ±5%; Voltage Rated: 50V; Temperature Coefficient: C0G
C3 C4 = CL10C180JB8NNNC: 容值:18pF;精度:±5%;额定电压:50V;材质(温度系数):C0G;; LCSC Part Name: 18pF ±5% 50V; Supplier Part: C1647; Manufacturer: SAMSUNG(三星); Supplier Footprint: 0603; JLCPCB Part Class: Basic Part; Datasheet: https://atta.szlcsc.com/upload/public/pdf/source/20160218/1457707763339.pdf; Supplier: LCSC; Tolerance: ±5%; Voltage Rated: 50V; Temperature Coefficient: C0G
C23 = CL10A475KO8NNNC: 容值:4.7uF;精度:±10%;额定电压:16V;材质(温度系数):X5R;; LCSC Part Name: 4.7uF ±10% 16V; Supplier Part: C19666; Manufacturer: SAMSUNG(三星); Supplier Footprint: 0603; JLCPCB Part Class: Basic Part; Datasheet: https://atta.szlcsc.com/upload/public/pdf/source/20160218/1457707763339.pdf; Supplier: LCSC; Tolerance: ±10%; Voltage Rated: 16V; Temperature Coefficient: X5R
C36 C39 = CL10A105KB8NNNC: 容值:1uF;精度:±10%;额定电压:50V;材质(温度系数):X5R;; LCSC Part Name: 1uF ±10% 50V; Supplier Part: C15849; Manufacturer: SAMSUNG(三星); Supplier Footprint: 0603; JLCPCB Part Class: Basic Part; Datasheet: https://atta.szlcsc.com/upload/public/pdf/source/20160218/1457707763339.pdf; Supplier: LCSC; Tolerance: ±10%; Voltage Rated: 50V; Temperature Coefficient: X5R
JP1 JP2 = Jumper 1x3P
L1 L2 = 0.5A,600Ω@100Mhz
R13 R14 R34 = 0603WAF1002T5E: 电阻类型:厚膜电阻;阻值:10kΩ;精度:±1%;功率:100mW;温度系数:±100ppm/℃;最大工作电压:75V;工作温度范围:-55℃~+155℃;; LCSC Part Name: 10kΩ ±1% 100mW; Supplier Part: C25804; Manufacturer: UNI-ROYAL(厚声); Supplier Footprint: 0603; JLCPCB Part Class: Basic Part; Datasheet: https://atta.szlcsc.com/upload/public/pdf/source/20200306/C422600_1E6D84923E4A46A82E41ADD87F860B5C.pdf; Supplier: LCSC; Type: 厚膜电阻; Tolerance: ±1%; Power(Watts): 100mW; Temperature Coefficient: ±100ppm/℃; Overload Voltage (Max): 75V; Operating Temperature Range: -55℃~+155℃
U1 = AT32F457ZET7
X1 = X206032768KGB2SC: 晶振类型:直插晶振;频率:32.768kHz;常温频差:±10ppm;负载电容:12.5pF;频率稳定度:-;; LCSC Part Name: 32.768kHz ±10ppm 12.5pF; Supplier Part: C2236; Manufacturer: YXC(扬兴晶振); Supplier Footprint: DT-26; JLCPCB Part Class: Extended Part; Datasheet: https://atta.szlcsc.com/upload/public/pdf/source/20240329/2B52AA05409D3B1EC46EE0917D3AF97A.pdf; Supplier: LCSC; Crystal Type: 直插晶振; Normal temperature Frequency Tolerance: ±10ppm; Load Capacitor: 12.5pF; Operating Temperature: -20℃~+70℃
Y1 = CJ13-080001210B20: 频率:8MHz;常温频差:±10ppm;外接负载电容:12pF;; LCSC Part Name: 8MHz ±10ppm 12pF; Supplier Part: C2875274; Manufacturer: CJ(江苏长电/长晶); Supplier Footprint: SMD3225-4P; JLCPCB Part Class: Extended Part; Datasheet: https://atta.szlcsc.com/upload/public/pdf/source/20210824/6E1F59D92CEEC2B7E10E0FA064B9C05B.pdf; Supplier: LCSC; Normal temperature Frequency Tolerance: ±10ppm; External load capacitor: 12pF; Paste Type: recommend
C5 C7 = CL10A106KP8NNNC: 容值:10uF;精度:±10%;额定电压:10V;材质(温度系数):X5R;; LCSC Part Name: 10uF ±10% 10V; Supplier Part: C19702; Manufacturer: SAMSUNG(三星); Supplier Footprint: 0603; JLCPCB Part Class: Basic Part; Datasheet: https://atta.szlcsc.com/upload/public/pdf/source/20160218/1457707763339.pdf; Supplier: LCSC; Tolerance: ±10%; Voltage Rated: 10V; Temperature Coefficient: X5R
CN1 = JTJ-USB-AF-08: Supplier: LCSC; image: //image.lceda.cn/szlcsc/C2345.jpg; Supplier Part: C2345; Paste Type: expand
CN4 = CON10A_0
D1 D2 = DFLS130L-7: Supplier: LCSC; Supplier Part: C110493; Manufacturer: Diodes Incorporated; Paste Type: expand
F1 = SMD0603B035TF: Supplier: LCSC; Supplier Part: C269154; Manufacturer: Brightking Elec (TAIWAN); Paste Type: expand
J8 = PZ2.54-1*4-WZ: 插针结构:1x4P;间距:2.54mm;安装类型:弯插;排数:单排;总PIN位数:4P;触头镀层:金;; Supplier Part: C5224015; Manufacturer: ZHOURI(洲日); Supplier Footprint: 弯插,P=2.54mm; JLCPCB Part Class: Extended Part; Datasheet: https://atta.szlcsc.com/upload/public/pdf/source/20221031/5E07F614DEAC37F80EB82945E6A3298C.pdf; Supplier: LCSC; Pin Structure: 1x4P; Pitch: 2.54mm; Mounting Type: 弯插; Number of Rows: 单排; Number of Pins: 4P; Contact Plating: 金; Design Item ID: Header 4; Library Name: Miscellaneous Connectors; LatestRevisionDate: 17-Jul-2002; LatestRevisionNote: Re-released for DXP Platform.; Publisher: Altium Limited
JP3 JP4 = Jumper 1x2P
LED1 LED2 = RED
LED3 = YELLOW
LED4 = GREEN
R10 R26-R28 = 0603WAF1001T5E: 电阻类型:厚膜电阻;阻值:1kΩ;精度:±1%;功率:100mW;温度系数:±100ppm/℃;最大工作电压:75V;工作温度范围:-55℃~+155℃;; LCSC Part Name: 1kΩ ±1% 100mW; Supplier Part: C21190; Manufacturer: UNI-ROYAL(厚声); Supplier Footprint: 0603; JLCPCB Part Class: Basic Part; Datasheet: https://atta.szlcsc.com/upload/public/pdf/source/20200306/C422600_1E6D84923E4A46A82E41ADD87F860B5C.pdf; Supplier: LCSC; Type: 厚膜电阻; Tolerance: ±1%; Power(Watts): 100mW; Temperature Coefficient: ±100ppm/℃; Overload Voltage (Max): 75V; Operating Temperature Range: -55℃~+155℃
R15 = 0603WAF1502T5E: 电阻类型:厚膜电阻;阻值:15kΩ;精度:±1%;功率:100mW;温度系数:±100ppm/℃;最大工作电压:75V;工作温度范围:-55℃~+155℃;; LCSC Part Name: 15kΩ ±1% 100mW; Supplier Part: C22809; Manufacturer: UNI-ROYAL(厚声); Supplier Footprint: 0603; JLCPCB Part Class: Basic Part; Datasheet: https://atta.szlcsc.com/upload/public/pdf/source/20200306/C422600_1E6D84923E4A46A82E41ADD87F860B5C.pdf; Supplier: LCSC; Type: 厚膜电阻; Tolerance: ±1%; Power(Watts): 100mW; Temperature Coefficient: ±100ppm/℃; Overload Voltage (Max): 75V; Operating Temperature Range: -55℃~+155℃
R16 = 0603WAF5102T5E: 电阻类型:厚膜电阻;阻值:51kΩ;精度:±1%;功率:100mW;温度系数:±100ppm/℃;最大工作电压:75V;工作温度范围:-55℃~+155℃;; LCSC Part Name: 51kΩ ±1% 100mW; Supplier Part: C23196; Manufacturer: UNI-ROYAL(厚声); Supplier Footprint: 0603; JLCPCB Part Class: Basic Part; Datasheet: https://atta.szlcsc.com/upload/public/pdf/source/20200306/C422600_1E6D84923E4A46A82E41ADD87F860B5C.pdf; Supplier: LCSC; Type: 厚膜电阻; Tolerance: ±1%; Power(Watts): 100mW; Temperature Coefficient: ±100ppm/℃; Overload Voltage (Max): 75V; Operating Temperature Range: -55℃~+155℃
R18 = 0603WAF1003T5E: 电阻类型:厚膜电阻;阻值:100kΩ;精度:±1%;功率:100mW;温度系数:±100ppm/℃;最大工作电压:75V;工作温度范围:-55℃~+155℃;; LCSC Part Name: 100kΩ ±1% 100mW; Supplier Part: C25803; Manufacturer: UNI-ROYAL(厚声); Supplier Footprint: 0603; JLCPCB Part Class: Basic Part; Datasheet: https://atta.szlcsc.com/upload/public/pdf/source/20200306/C422600_1E6D84923E4A46A82E41ADD87F860B5C.pdf; Supplier: LCSC; Type: 厚膜电阻; Tolerance: ±1%; Power(Watts): 100mW; Temperature Coefficient: ±100ppm/℃; Overload Voltage (Max): 75V; Operating Temperature Range: -55℃~+155℃
R21 R22 = 0603WAF330JT5E: 电阻类型:厚膜电阻;阻值:33Ω;精度:±1%;功率:100mW;温度系数:±100ppm/℃;最大工作电压:75V;工作温度范围:-55℃~+155℃;; LCSC Part Name: 33Ω ±1% 100mW; Supplier Part: C23140; Manufacturer: UNI-ROYAL(厚声); Supplier Footprint: 0603; JLCPCB Part Class: Basic Part; Datasheet: https://atta.szlcsc.com/upload/public/pdf/source/20200306/C422600_1E6D84923E4A46A82E41ADD87F860B5C.pdf; Supplier: LCSC; Type: 厚膜电阻; Tolerance: ±1%; Power(Watts): 100mW; Temperature Coefficient: ±100ppm/℃; Overload Voltage (Max): 75V; Operating Temperature Range: -55℃~+155℃
R23-R25 = 0603WAF4700T5E: 电阻类型:厚膜电阻;阻值:470Ω;精度:±1%;功率:100mW;温度系数:±100ppm/℃;最大工作电压:75V;工作温度范围:-55℃~+155℃;; LCSC Part Name: 470Ω ±1% 100mW; Supplier Part: C23179; Manufacturer: UNI-ROYAL(厚声); Supplier Footprint: 0603; JLCPCB Part Class: Basic Part; Datasheet: https://atta.szlcsc.com/upload/public/pdf/source/20200306/C422600_1E6D84923E4A46A82E41ADD87F860B5C.pdf; Supplier: LCSC; Type: 厚膜电阻; Tolerance: ±1%; Power(Watts): 100mW; Temperature Coefficient: ±100ppm/℃; Overload Voltage (Max): 75V; Operating Temperature Range: -55℃~+155℃
R30 R31 = 0603WAF0000T5E: 电阻类型:厚膜电阻;阻值:0Ω;精度:±1%;功率:100mW;最大工作电压:75V;; LCSC Part Name: 0Ω ±1% 100mW 厚膜电阻; Supplier Part: C21189; Manufacturer: UNI-ROYAL(厚声); Supplier Footprint: 0603; JLCPCB Part Class: Basic Part; Datasheet: https://atta.szlcsc.com/upload/public/pdf/source/20200306/C422600_1E6D84923E4A46A82E41ADD87F860B5C.pdf; Supplier: LCSC; Type: 厚膜电阻; Tolerance: ±1%; Power(Watts): 100mW; Overload Voltage (Max): 75V; Operating Temperature Range: -55℃~+155℃; Temperature Coefficient: ±100ppm/℃
RP2 = 33R
T1 T2 = TESTPOINT TP-5006: LatestRevisionDate: 17-Jul-2002; LatestRevisionNote: Re-released for DXP Platform.; Publisher: Altium Limited
U2 = RT9080N-08GJ5
U8 = EN25QH128A-104HIP

## Nets
3V3: C13.1 CN4.1 CN7.1 D1.1 D4.1(C) D5.1 J4.2 J4.4 J8.1 JP3.1 R10.1 R17.1 R26.1 R27.1 R28.1 U8.8(VCC)
5V: CN1.1(VCC) CN4.2 CN7.2 D2.1 D3.1 F1.1 J4.5 J7.2
GND: B1.2 B1.4 C1.1 C2.1 C3.1 C4.1 C5.2 C6.2 C7.2 C8.1 C9.1 C10.1 C11.1 C12.1 C13.2 C14.1 C15.1 C16.1 C17.1 C18.1 C19.1 C20.1 C21.2 C22.1 C23.2 C24.2 C25.2 C26.2 C27.2 C28.2 C29.2 C30.2 C31.2 C32.2 C33.2 C34.2 C35.2 C36.2 C37.2 C38.2 C39.2 C40.2 CN1.4(GND) CN2.A1B12(GND) CN2.B1A12(GND) CN4.9 CN6.A1B12(GND) CN6.B1A12(GND) CN7.9 D4.2(A) J1.11 J1.22 J1.35 J1.48 J1.58 J1.71 J2.16 J2.31 J2.38 J2.51 J2.61 J3.7 J4.6 J4.7 J7.6 J8.4 JP1.3 JP2.3 LED1.2(CATHODE) P1.5 R15.2 R18.1 R32.1 R33.1 R35.1 R49.2 R51.2 R86.2 R87.2 R88.2 T1.1 T2.1 TP3.4 U1.16(VSS) U1.31(VSSA) U1.38(VSS) U1.51(VSS) U1.61(VSS) U1.83(VSS) U1.94(VSS) U1.107(VSS) U1.120(VSS) U1.130(VSS) U1.143(VSS) U2.2(GND) U5.2(GND) U6.8(VSSA) U6.20(PB2) U6.23(VSS_1) U6.35(VSS_2) U6.39(PB3) U6.40(PB4) U6.47(VSS_3) U7.2(GND) U8.4(GND) Y1.2(GND) Y1.4(GND)
VBAT: C35.1 J2.6 R9.1 U1.6(VBAT)
VBUS: CN2.A4B9(VBUS) CN2.B4A9(VBUS) D2.2 R34.2
VCC: C8.2 C9.2 C10.2 C11.2 C12.2 C14.2 J9.1 P1.1 R43.1 RP1.1 RP1.2 RP1.3 RP1.4 U6.1(VBAT) U6.9(VDDA) U6.24(VDD_1) U6.36(VDD_2) U6.48(VDD_3) U7.5(OUT)
VCC3.5V: C17.2 D5.2 R50.1 U5.5(OUT)
VDD: B2.1 B2.3 C23.1 C24.1 C25.1 C26.1 C27.1 C28.1 C29.1 C30.1 C31.1 C32.1 C33.1 C34.1 J1.12 J1.23 J1.36 J1.49 J1.59 J1.72 J2.17 J2.39 J2.52 J2.62 J2.72 JP1.1 JP2.1 JP3.2 L1.1 L2.1 R9.2 R17.2 U1.17(VDD) U1.39(VDD) U1.52(VDD) U1.62(VDD) U1.72(VDD) U1.84(VDD) U1.95(VDD) U1.108(VDD) U1.121(VDD) U1.131(VDD) U1.144(VDD)
VDDA: C36.1 C37.1 J2.33 L1.2 U1.33(VDDA)
ATLINK_5V: CN6.A4B9(VBUS) CN6.B4A9(VBUS) D3.2 F2.1 TP3.1
ATLK_BOOT0: R45.1 U6.27(PB14)
ATLK_NRST: R46.1 U6.28(PB15)
ATLK_RX: CN4.10 CN7.10 R25.1 R48.2
ATLK_SWCLK: R41.1 U6.25(PB12)
ATLK_SWDIO: R44.1 U6.26(PB13)
ATLK_SWO: R52.1 U6.13(PA3)
ATLK_TX: CN4.8 CN7.8 R24.1 R47.2
BOOT0: CN4.4 CN7.4 J1.66 R13.2 R45.2 U1.138(BOOT0)
CC1: CN6.A5(CC1) R86.1
CC2: CN6.B5(CC2) R87.1
EGND: C20.2 CN6.13(GND) CN6.14(GND) CN6.15(GND) CN6.16(GND) R88.1
EGND1: C21.1 CN1.SH1 CN1.SH2 CN2.13(GND) CN2.14(GND) CN2.15(GND) CN2.16(GND) R35.2
LD1: LD1.2(CATHODE) U6.10(PA0/WKUP)
LD2: LD2.2(CATHODE) U6.11(PA1)
LD3: LD3.2(CATHODE) U6.12(PA2)
LD4: LD4.2(CATHODE) U6.19(PB1)
M-ATLK_RX: R48.1 U6.31(PA10)
M-ATLK_TX: R47.1 U6.30(PA9)
M-BOOT0: J9.2 U6.44(BOOT0)
M-NRST: C22.2 P1.4 U6.7(NRST)
M-SWCLK: P1.3 U6.37(PA14)
M-SWDIO: P1.2 U6.34(PA13)
M-USB_DM: R12.2 U6.32(PA11)
M-USB_DP: R11.2 U6.33(PA12)
NRST: B1.1 B1.3 C40.1 CN4.7 CN7.7 J2.25 J4.3 J7.5 R46.2 U1.25(NRST)
OTGFS1_D+: CN1.3(D+) CN2.A6(DP1) CN2.B6(DP2) R30.2
OTGFS1_D-: CN1.2(D-) CN2.A7(DN1) CN2.B7(DN2) R31.2
PA0: J2.34 J6.1 R19.2 U1.34(PA0)
PA1: J2.35 J6.2 U1.35(PA1)
PA2: J2.36 J5.2 U1.36(PA2)
PA3: J2.37 J5.1 U1.37(PA3)
PA4: J2.40 J6.3 U1.40(PA4)
PA5: J2.41 J3.6 U1.41(PA5)
PA6: J2.42 J3.5 U1.42(PA6)
PA7: J2.43 J3.4 U1.43(PA7)
PA8: J1.28 J5.8 U1.100(PA8)
PA9: J1.29 J3.1 J8.2 JP4.1 R25.2 U1.101(PA9)
PA10: J1.30 J5.3 J8.3 R24.2 U1.102(PA10)
PA11: R31.1 R54.2 U1.103(PA11)
PA11_E: J1.31 R54.1
PA12: R30.1 R55.2 U1.104(PA12)
PA12_E: J1.32 R55.1
PA13/SWDIO: CN4.3 CN7.3 J1.33 R44.2 U1.105(PA13)
PA14/SWCLK: CN4.5 CN7.5 J1.37 R41.2 U1.109(PA14)
PA15: J1.38 R61.1 U1.110(PA15)
PB0: J2.46 J6.4 U1.46(PB0)
PB1: J2.47 U1.47(PB1)
PB2/BOOT1: J2.48 R14.2 U1.48(PB2/BOOT1)
PB3: J1.61 J5.4 R23.2 U1.133(PB3)
PB4: J1.62 J5.6 U1.134(PB4)
PB5: J1.63 J5.5 U1.135(PB5)
PB6: J1.64 R60.2 U1.136(PB6)
PB7: J1.65 U1.137(PB7)
PB8: J1.67 J3.10 R58.1 U1.139(PB8)
PB9: J1.68 J3.9 R56.1 U1.140(PB9)
PB10: J2.69 J5.7 U1.69(PB10)
PB11: J2.70 J7.8 U1.70(PB11)
PB12: J1.1 J7.7 U1.73(PB12)
PB13: J1.2 J7.3 U1.74(PB13)
PB14: J1.3 J7.1 U1.75(PB14)
PB15: J1.4 J7.4 U1.76(PB15)
PC0: J2.26 R59.1 U1.26(PC0)
PC1: J2.27 R57.1 U1.27(PC1)
PC2: J2.28 U1.28(PC2)
PC3: J2.29 U1.29(PC3)
PC4: J2.44 U1.44(PC4)
PC5: J2.45 U1.45(PC5)
PC6: J1.24 U1.96(PC6)
PC7: J1.25 J3.2 U1.97(PC7)
PC8: J1.26 U1.98(PC8)
PC9: J1.27 U1.99(PC9)
PC10: J1.39 U1.111(PC10)
PC11: J1.40 U1.112(PC11)
PC12: J1.41 U1.113(PC12)
PC13: J2.7 R20.2 U1.7(PC13)
PC14/LEXT_IN: R5.2 R7.2 U1.8(PC14/LEXT_IN)
PC14_E: J2.8 R7.1
PC15/LEXT_OUT: R6.2 R8.2 U1.9(PC15/LEXT_OUT)
PC15_E: J2.9 R8.1
PD0: J1.42 U1.114(PD0)
PD1: J1.43 U1.115(PD1)
PD2: J1.44 U1.116(PD2)
PD3: J1.45 U1.117(PD3)
PD4: J1.46 U1.118(PD4)
PD5: J1.47 U1.119(PD5)
PD6: J1.50 U1.122(PD6)
PD7: J1.51 U1.123(PD7)
PD8: J1.5 U1.77(PD8)
PD9: J1.6 U1.78(PD9)
PD10: J1.7 U1.79(PD10)
PD11: J1.8 U1.80(PD11)
PD12: J1.9 U1.81(PD12)
PD13: J1.10 LED2.2(CATHODE) U1.82(PD13)
PD14: J1.13 LED3.2(CATHODE) U1.85(PD14)
PD15: J1.14 LED4.2(CATHODE) U1.86(PD15)
PE0: J1.69 U1.141(PE0)
PE1: J1.70 U1.142(PE1)
PE2: J2.1 U1.1(PE2)
PE3: J2.2 U1.2(PE3)
PE4: J2.3 U1.3(PE4)
PE5: J2.4 U1.4(PE5)
PE6: J2.5 U1.5(PE6)
PE7: J2.58 U1.58(PE7)
PE8: J2.59 U1.59(PE8)
PE9: J2.60 U1.60(PE9)
PE10: J2.63 U1.63(PE10)
PE11: J2.64 U1.64(PE11)
PE12: J2.65 U1.65(PE12)
PE13: J2.66 U1.66(PE13)
PE14: J2.67 U1.67(PE14)
PE15: J2.68 U1.68(PE15)
PF0: J2.10 U1.10(PF0)
PF1: J2.11 U1.11(PF1)
PF2: J2.12 U1.12(PF2)
PF3: J2.13 U1.13(PF3)
PF4: J2.14 U1.14(PF4)
PF5: J2.15 U1.15(PF5)
PF6: J2.18 RP2.4 U1.18(PF6)
PF7: J2.19 RP2.3 U1.19(PF7)
PF8: J2.20 RP2.2 U1.20(PF8)
PF9: J2.21 RP2.1 U1.21(PF9)
PF10: J2.22 R21.1 U1.22(PF10)
PF11: J2.49 U1.49(PF11)
PF12: J2.50 U1.50(PF12)
PF13: J2.53 U1.53(PF13)
PF14: J2.54 U1.54(PF14)
PF15: J2.55 U1.55(PF15)
PG0: J2.56 U1.56(PG0)
PG1: J2.57 U1.57(PG1)
PG2: J1.15 U1.87(PG2)
PG3: J1.16 U1.88(PG3)
PG4: J1.17 U1.89(PG4)
PG5: J1.18 U1.90(PG5)
PG6: J1.19 R22.1 U1.91(PG6)
PG7: J1.20 U1.92(PG7)
PG8: J1.21 U1.93(PG8)
PG9: J1.52 U1.124(PG9)
PG10: J1.53 U1.125(PG10)
PG11: J1.54 U1.126(PG11)
PG12: J1.55 U1.127(PG12)
PG13: J1.56 U1.128(PG13)
PG14: J1.57 U1.129(PG14)
PG15: J1.60 U1.132(PG15)
PH0/HEXT_IN: R1.2 R2.2 U1.23(PH0/HEXT_IN)
PH0_E: J2.23 R2.1
PH1/HEXT_OUT: R3.2 R4.2 U1.24(PH1/HEXT_OUT)
PH1_E: J2.24 R4.1
PH2: J1.34 U1.106(PH2)
PH3: J2.71 U1.71(PH3)
PH4: J2.30 U1.30(PH4)
QSPI1_CS: R22.2 U8.1(CS)
QSPI1_IO0: RP2.7 U8.5(DI(IO0))
QSPI1_IO1: RP2.8 U8.2(DO(IO1))
QSPI1_IO2: RP2.6 U8.3(IO2)
QSPI1_IO3: RP2.5 U8.7(IO3)
QSPI1_SCK: R21.2 U8.6(CLK)
SWO: CN4.6 CN7.6 R23.1 R52.2
USBM: CN6.A7(DN1) CN6.B7(DN2) R12.1 TP3.2
USBP: CN6.A6(DP1) CN6.B6(DP2) R11.1 TP3.3
VREF+: C38.1 C39.1 J2.32 J3.8 L2.2 U1.32(VREF+)
$2N452: C1.2 R1.1 Y1.1
$2N453: C2.2 R3.1 Y1.3
$2N511: C3.2 R5.1 X1.1(OSC1)
$2N512: C4.2 R6.1 X1.2(OSC2)
$2N701: JP1.2 R13.1
$2N702: JP2.2 R14.1
$3N58: C5.1 C6.1 F1.2 U2.1(IN) U2.3(EN)
$3N81: R15.1 R16.1 U2.4(SNS)
$3N82: C7.1 D1.2 R16.2 U2.5(OUT)
$3N119: LED1.1(ANODE) R10.2
$3N184: B2.2 B2.4 R18.2 R19.1 R20.1
$3N504: LED2.1(ANODE) R26.2
$3N505: LED3.1(ANODE) R27.2
$3N506: LED4.1(ANODE) R28.2
$3N17443: CN2.B5(CC2) R33.2
$3N17484: CN2.A5(CC1) R32.2
$3N17593: JP4.2 R34.1
$4N269: J6.5 R56.2 R57.2
$4N270: J6.6 R58.2 R59.2
$4N339: J3.3 R60.1 R61.2
$6N792: LD1.1(ANODE) RP1.8
$6N793: LD2.1(ANODE) RP1.7
$6N794: LD3.1(ANODE) RP1.6
$6N795: LD4.1(ANODE) RP1.5
$6N16959: C15.2 C16.2 C18.2 C19.2 F2.2 U5.1(IN) U5.3(EN) U7.1(IN) U7.3(EN)
$6N17598: R43.2 R49.1 U7.4(SNS)
$6N17675: R50.2 R51.1 U5.4(SNS)

Not connected (* = marked no-connect by the designer): CN2 A8(SBU1)* B8(SBU2)*; CN6 A8(SBU1)* B8(SBU2)*; J4 1* 8*; U6 2(PC13/TAMPER_RTC)* 3(PC14/LEXT_IN)* 4(PC15/LEXT_OUT)* 5(PD0/HEXT_IN)* 6(PD1/HEXT_OUT)* 14(PA4)* 15(PA5)* 16(PA6)* 17(PA7)* 18(PB0)* 21(PB10)* 22(PB11)* 29(PA8)* 38(PA15)* 41(PB5)* 42(PB6)* 43(PB7)* 45(PB8)* 46(PB9)*

## Notes on the sheets
sheet 1
- MCU
- MCU power supply
- AT-START-F455
- Crystal
- Boot & Reset
- 2025-01-20
sheet 2
- AT-START power supply
- USB_host
- LED
- QSPI flash
- USB_Device
- Test point
- AT-Link connector
- AT-START-F455
- USART1 / OTG1 selection
- User key
- 2025-01-20
sheet 3
- SCL
- SDA
- D12
- D13
- D11
- D10
- D9
- D8
- D7
- D6
- AN0
- D5
- AN1
- D4
- AN2
- D3
- AN3
- AN4
- D1_TX
- D2
- AN5
- D0_RX
- SCK
- NSS
- MISO
- MOSI
- Arduino UNO R3 connectors
- AT-START-F455
- LQFP144 I/O extension connectors
- 2025-01-20
sheet 4
- Close to slot
- For Test
- AT-Link USB
- AT-Link power supply
- AT-Link EZ CN7 to AT-START CN2 connection
- LD1-4:For AT-Link-EZ status
- AT-START-F455
- AT-Link MCU
- 2025-01-20
